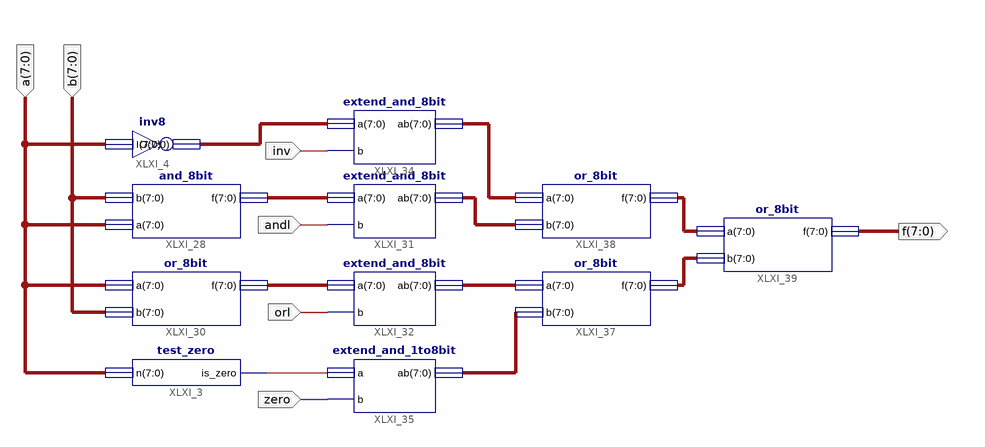
[diagram p0: schematic sheet 1]
// Xilinx ISE schematic alu_logical.sch (spartan3e) as structural Verilog: 11 symbols, 7 ports
module alu_logical (
  input  [7:0] a,
  input  [7:0] b,
  input  andl,
  input  orl,
  input  zero,
  input  inv,
  output [7:0] f
);

  wire XLXN_44;
  wire [7:0] XLXN_31, XLXN_32, XLXN_36, XLXN_45, XLXN_46, XLXN_47, XLXN_48, XLXN_49, XLXN_50;

  test_zero XLXI_3 (.n(a), .is_zero(XLXN_44));
  inv8 XLXI_4 (.I(a), .O(XLXN_36));
  and_8bit XLXI_28 (.b(b), .a(a), .f(XLXN_32));
  or_8bit XLXI_30 (.a(a), .b(b), .f(XLXN_31));
  extend_and_8bit XLXI_31 (.a(XLXN_32), .b(andl), .ab(XLXN_47));
  extend_and_8bit XLXI_32 (.a(XLXN_31), .b(orl), .ab(XLXN_46));
  extend_and_8bit XLXI_34 (.a(XLXN_36), .b(inv), .ab(XLXN_48));
  extend_and_1to8bit XLXI_35 (.a(XLXN_44), .b(zero), .ab(XLXN_45));
  or_8bit XLXI_37 (.a(XLXN_46), .b(XLXN_45), .f(XLXN_50));
  or_8bit XLXI_38 (.a(XLXN_48), .b(XLXN_47), .f(XLXN_49));
  or_8bit XLXI_39 (.a(XLXN_49), .b(XLXN_50), .f(f));
endmodule
